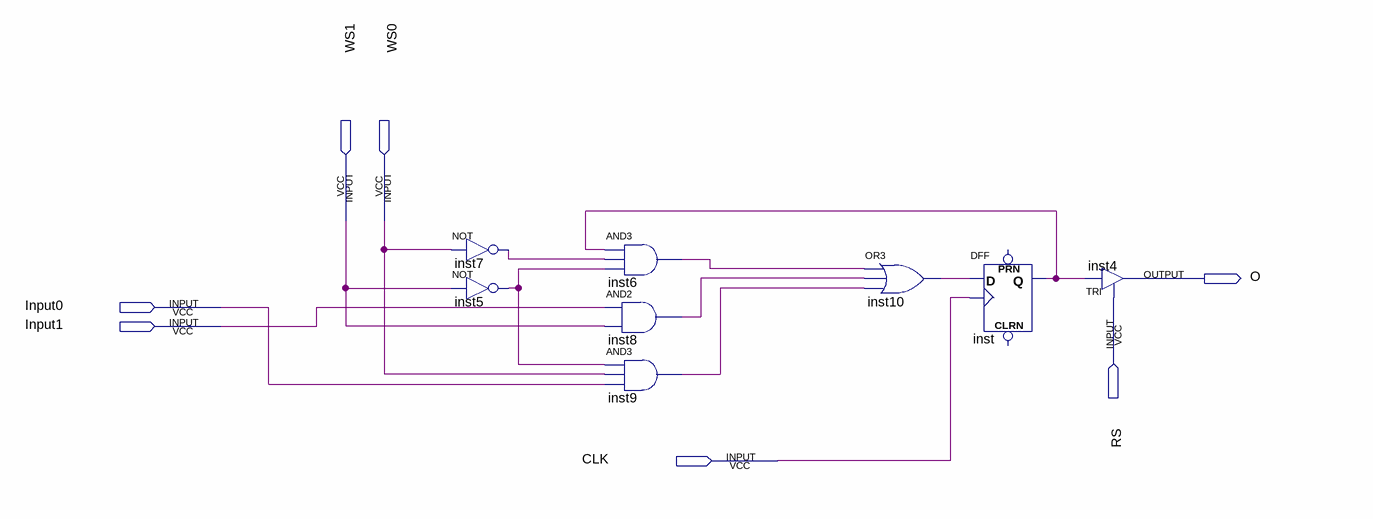
[diagram p0: schematic sheet]
// Quartus schematic RFC.bdf as structural Verilog: 8 symbols, 7 pins
module RFC (
  input  WS1,
  input  WS0,
  input  RS,
  input  Input0,
  input  Input1,
  input  CLK,
  output O
);

  wire inst5_out, inst6_out, inst7_out, inst8_out, inst9_out, inst10_out, inst_q;

  not inst7 (inst7_out, WS0);
  not inst5 (inst5_out, WS1);
  and inst6 (inst6_out, inst_q, inst7_out, inst5_out);
  and inst8 (inst8_out, Input1, WS1);
  and inst9 (inst9_out, inst5_out, WS0, Input0);
  or inst10 (inst10_out, inst6_out, inst8_out, inst9_out);
  DFF inst (.CLK(CLK), .D(inst10_out), .Q(inst_q));  // open: CLRN, PRN
  TRI inst4 (.IN(inst_q), .OE(RS), .OUT(O));
endmodule
